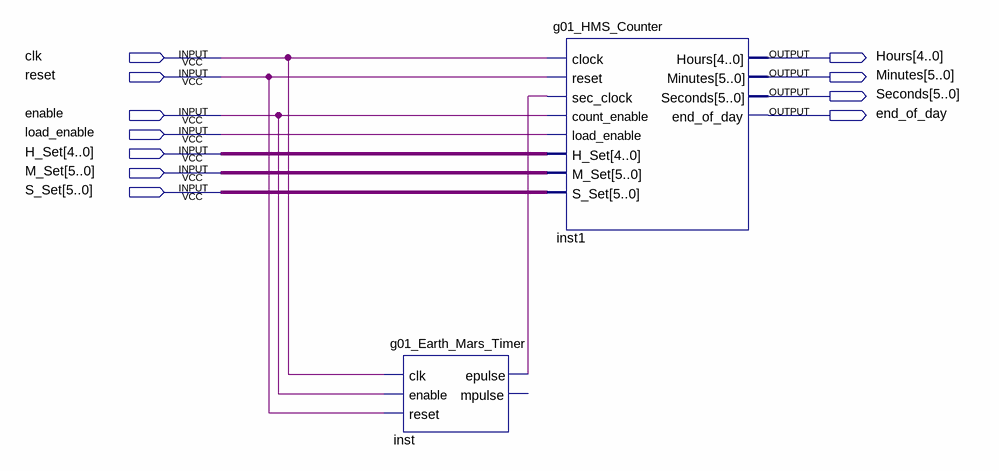
[diagram p0: schematic sheet]
// Quartus schematic Lab3.bdf as structural Verilog: 2 symbols, 11 pins
module Lab3 (
  input  clk,
  input  reset,
  input  enable,
  input  load_enable,
  input  [4:0] H_Set,
  input  [5:0] M_Set,
  input  [5:0] S_Set,
  output [4:0] Hours,
  output [5:0] Minutes,
  output [5:0] Seconds,
  output end_of_day
);

  wire inst_epulse;

  g01_Earth_Mars_Timer inst (.clk(clk), .enable(enable), .reset(reset), .epulse(inst_epulse));  // open: mpulse
  g01_HMS_Counter inst1 (
    .clock(clk), .reset(reset), .sec_clock(inst_epulse), .count_enable(enable), .load_enable(load_enable),
    .H_Set(H_Set), .M_Set(M_Set), .S_Set(S_Set), .Hours(Hours), .Minutes(Minutes), .Seconds(Seconds),
    .end_of_day(end_of_day));
endmodule
